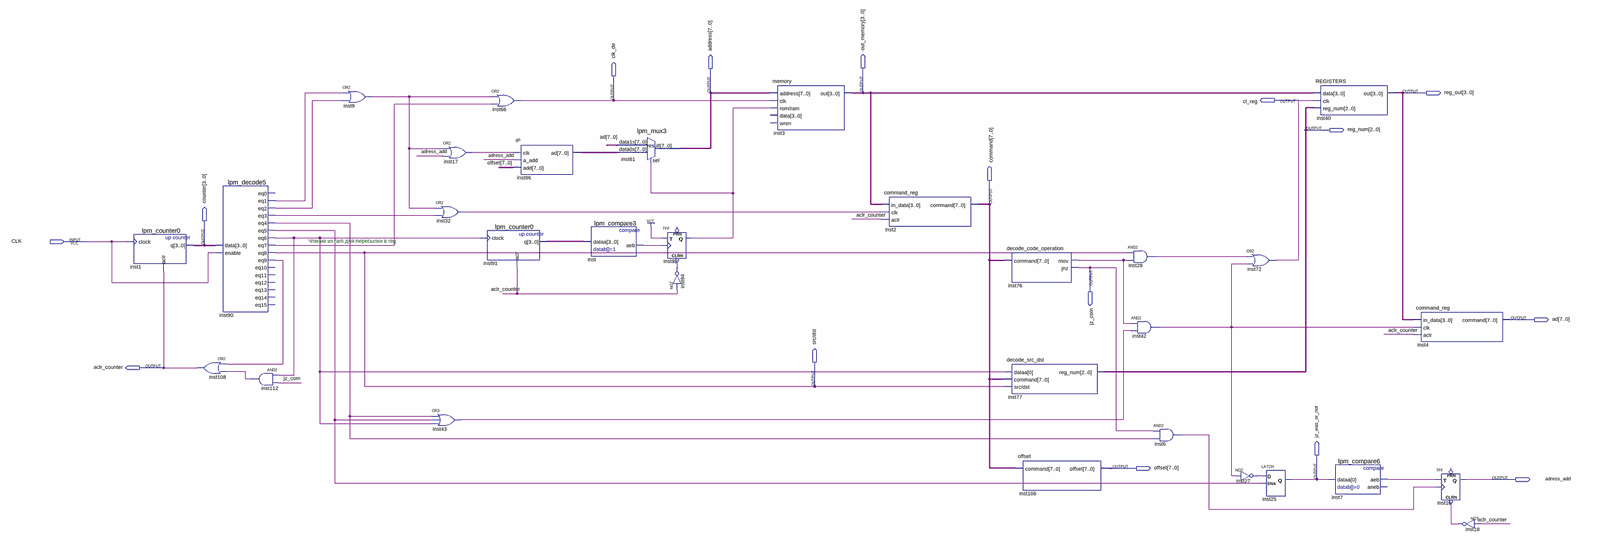
[diagram p0: schematic sheet, whole]
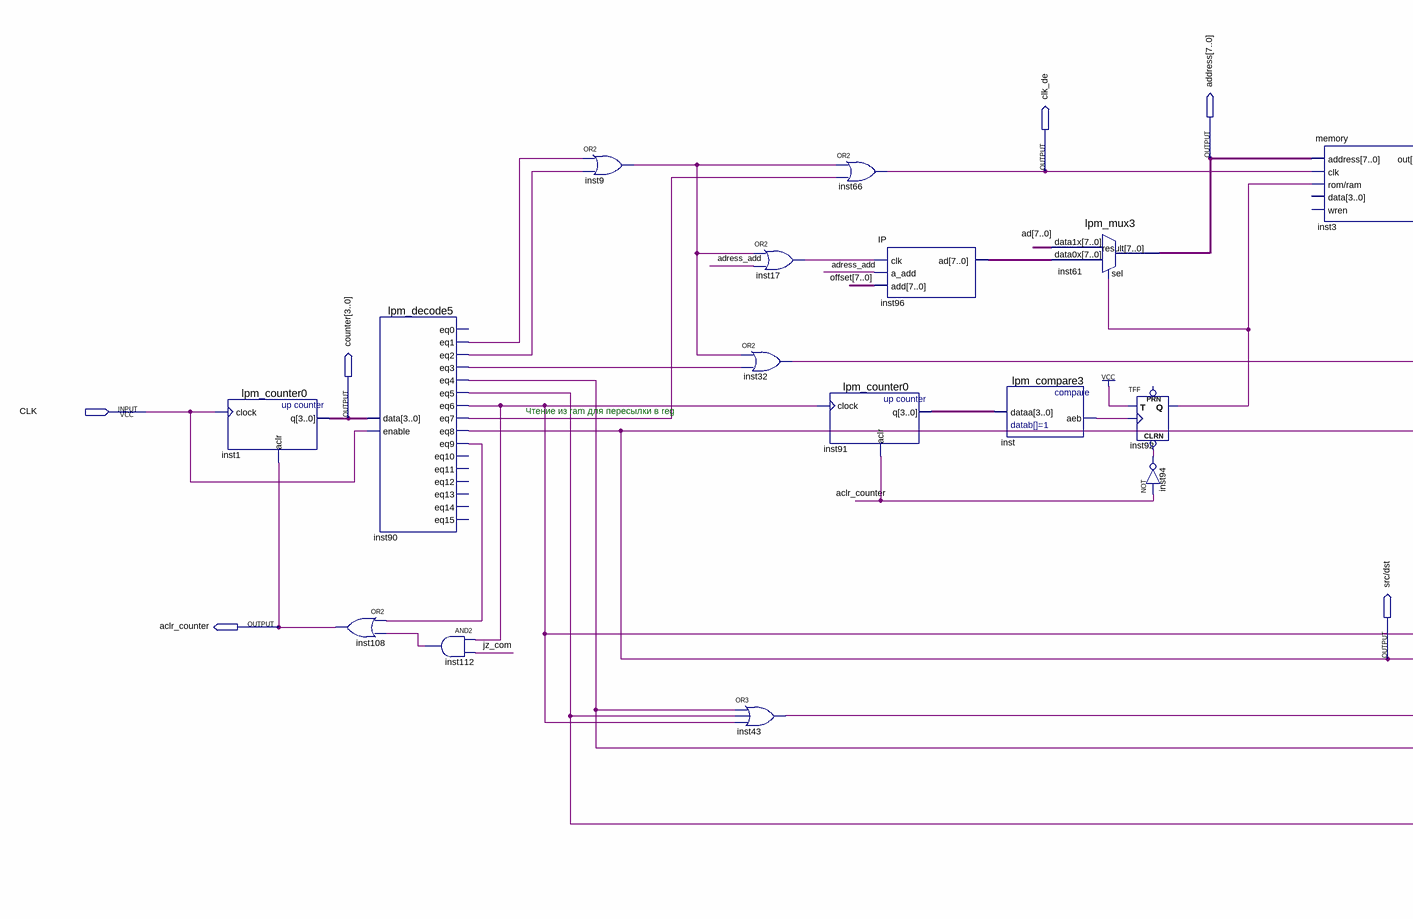
[diagram p1: schematic sheet, left part]
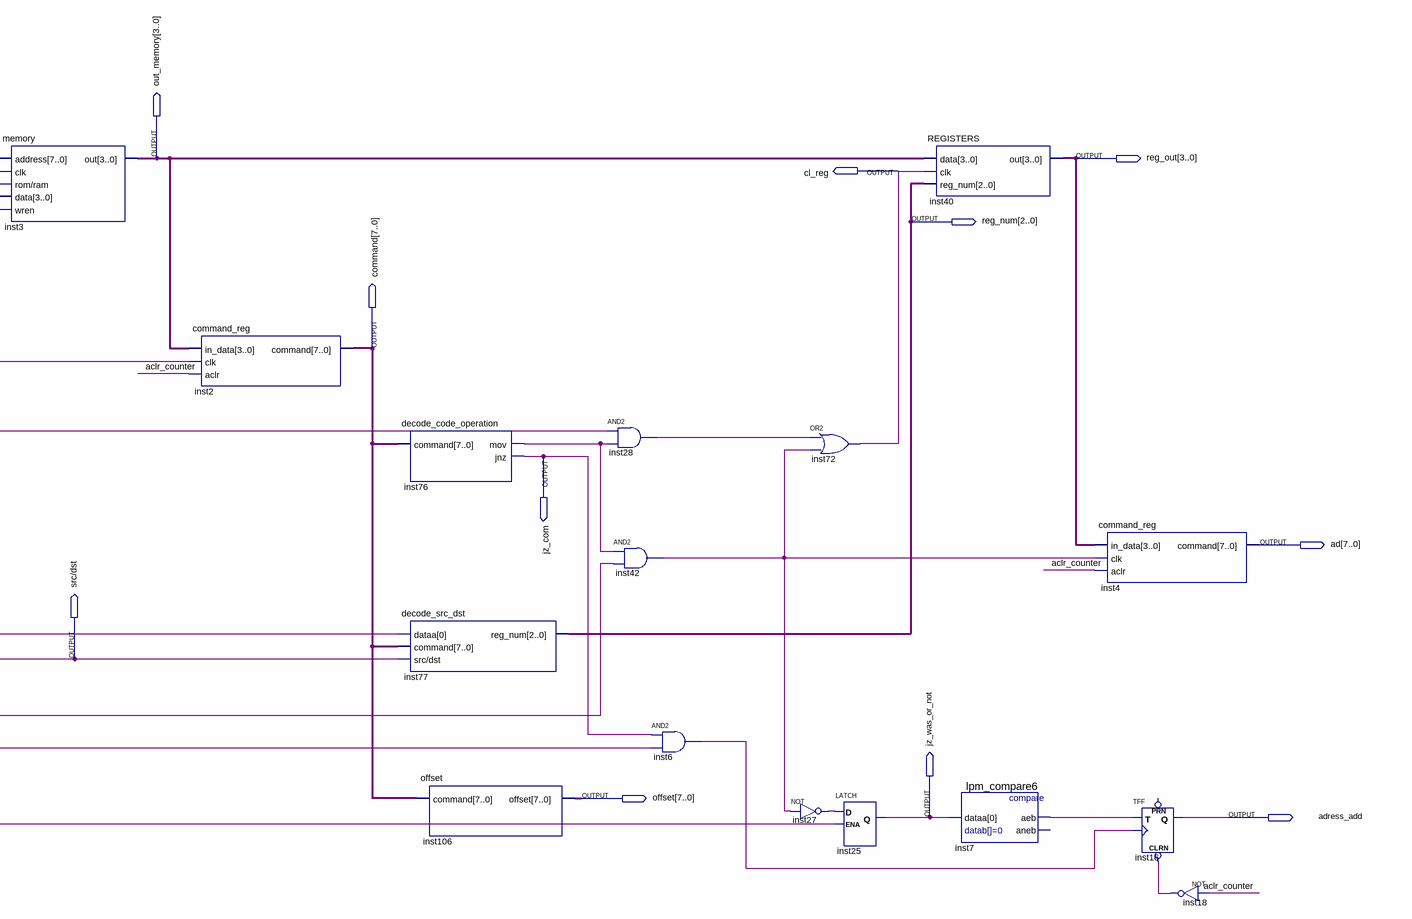
[diagram p2: schematic sheet, right part]
// Quartus schematic control_unit.bdf as structural Verilog: 31 symbols, 16 pins
module control_unit (
  input  CLK,
  output [7:0] address,
  output [3:0] out_memory,
  output [3:0] reg_out,
  output clk_de,
  output cl_reg,
  output [2:0] reg_num,
  output [7:0] command,
  output [3:0] counter,
  output jz_com,
  output [7:0] ad,
  output aclr_counter,
  output \src/dst ,
  output [7:0] offset,
  output jz_was_or_not,
  output adress_add
);

  wire inst6_out, inst7_aeb, inst9_out, inst17_out, inst18_out, inst27_out, inst28_out, inst32_out,
       inst42_out, inst43_out, inst76_mov, inst90_eq1, inst90_eq2, inst90_eq3, inst90_eq4, inst90_eq5,
       inst90_eq6, inst90_eq7, inst90_eq9, inst92_q, inst94_out, inst112_out, inst_aeb;
  wire [3:0] inst91_q;
  wire [7:0] inst96_ad;

  lpm_counter0 inst1 (.clock(CLK), .aclr(aclr_counter), .q(counter));
  or inst108 (aclr_counter, inst90_eq9, inst112_out);
  lpm_decode5 inst90 (
    .data(counter), .enable(CLK), .eq1(inst90_eq1), .eq2(inst90_eq2), .eq3(inst90_eq3), .eq4(inst90_eq4),
    .eq5(inst90_eq5), .eq6(inst90_eq6), .eq7(inst90_eq7), .eq8(\src/dst ), .eq9(inst90_eq9));  // open: eq0, eq10, eq11, eq12, eq13, eq14, eq15
  and inst112 (inst112_out, inst90_eq6, jz_com);
  or inst9 (inst9_out, inst90_eq1, inst90_eq2);
  or inst17 (inst17_out, inst9_out, adress_add);
  or inst32 (inst32_out, inst9_out, inst90_eq3);
  or inst43 (inst43_out, inst90_eq4, inst90_eq5, inst90_eq6);
  lpm_counter0 inst91 (.clock(inst90_eq6), .aclr(aclr_counter), .q(inst91_q));
  or inst66 (clk_de, inst9_out, inst90_eq7);
  IP inst96 (.clk(inst17_out), .a_add(adress_add), .add(offset), .ad(inst96_ad));
  lpm_compare3 inst (.dataa(inst91_q), .aeb(inst_aeb));
  lpm_mux3 inst61 (.data1x(ad), .data0x(inst96_ad), .sel(inst92_q), .result(address));
  TFF inst92 (.CLRN(inst94_out), .T(1'b1), .CLK(inst_aeb), .Q(inst92_q));  // open: PRN
  not inst94 (inst94_out, aclr_counter);
  memory inst3 (.address(address), .clk(clk_de), .\rom/ram (inst92_q), .out(out_memory));  // open: data, wren
  command_reg inst2 (.in_data(out_memory), .clk(inst32_out), .aclr(aclr_counter), .command(command));
  decode_code_operation inst76 (.command(command), .mov(inst76_mov), .jnz(jz_com));
  decode_src_dst inst77 (.dataa(inst90_eq6), .command(command), .\src/dst (\src/dst ), .reg_num(reg_num));
  offset inst106 (.command(command), .offset(offset));
  and inst28 (inst28_out, \src/dst , inst76_mov);
  and inst42 (inst42_out, inst76_mov, inst43_out);
  and inst6 (inst6_out, jz_com, inst90_eq4);
  or inst72 (cl_reg, inst28_out, inst42_out);
  not inst27 (inst27_out, inst42_out);
  LATCH inst25 (.D(inst27_out), .ENA(inst90_eq5), .Q(jz_was_or_not));
  REGISTERS inst40 (.data(out_memory), .clk(cl_reg), .reg_num(reg_num), .out(reg_out));
  lpm_compare6 inst7 (.dataa(jz_was_or_not), .aeb(inst7_aeb));  // open: aneb
  command_reg inst4 (.in_data(reg_out), .clk(inst42_out), .aclr(aclr_counter), .command(ad));
  TFF inst16 (.CLRN(inst18_out), .T(inst7_aeb), .CLK(inst6_out), .Q(adress_add));  // open: PRN
  not inst18 (inst18_out, aclr_counter);

  // Notes on the sheet:
  //   Чтение из ram для пересылки в reg
endmodule
